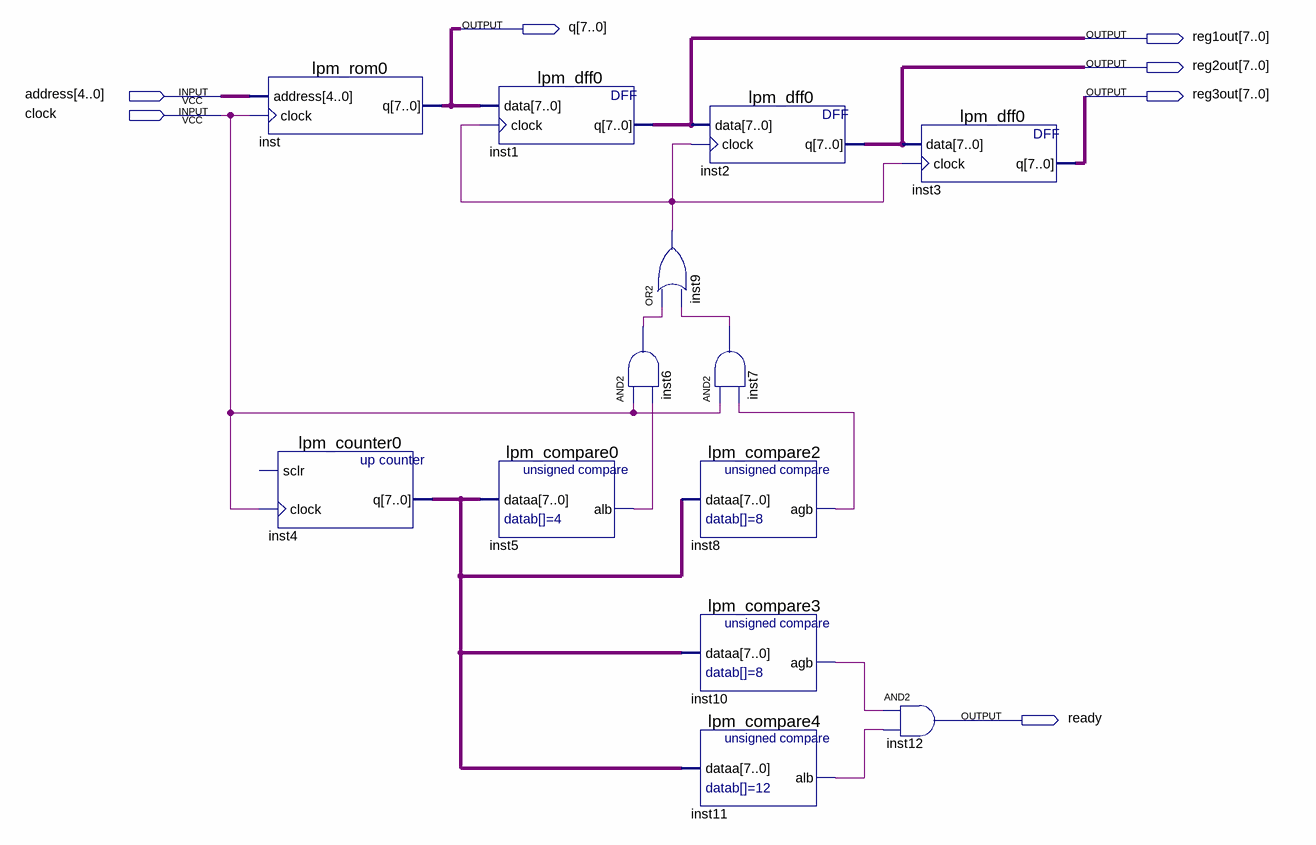
[diagram p0: schematic sheet]
// Quartus schematic romBlock.bdf as structural Verilog: 13 symbols, 7 pins
module romBlock (
  input  [4:0] address,
  input  clock,
  output [7:0] q,
  output [7:0] reg1out,
  output [7:0] reg2out,
  output [7:0] reg3out,
  output ready
);

  wire inst5_alb, inst6_out, inst7_out, inst8_agb, inst9_out, inst10_agb, inst11_alb;
  wire [7:0] inst4_q;

  lpm_rom0 inst (.address(address), .clock(clock), .q(q));
  lpm_counter0 inst4 (.clock(clock), .q(inst4_q));  // open: sclr
  lpm_dff0 inst1 (.data(q), .clock(inst9_out), .q(reg1out));
  lpm_compare0 inst5 (.dataa(inst4_q), .alb(inst5_alb));
  or inst9 (inst9_out, inst6_out, inst7_out);
  and inst6 (inst6_out, clock, inst5_alb);
  lpm_dff0 inst2 (.data(reg1out), .clock(inst9_out), .q(reg2out));
  and inst7 (inst7_out, clock, inst8_agb);
  lpm_compare2 inst8 (.dataa(inst4_q), .agb(inst8_agb));
  lpm_compare3 inst10 (.dataa(inst4_q), .agb(inst10_agb));
  lpm_compare4 inst11 (.dataa(inst4_q), .alb(inst11_alb));
  and inst12 (ready, inst10_agb, inst11_alb);
  lpm_dff0 inst3 (.data(reg2out), .clock(inst9_out), .q(reg3out));
endmodule
